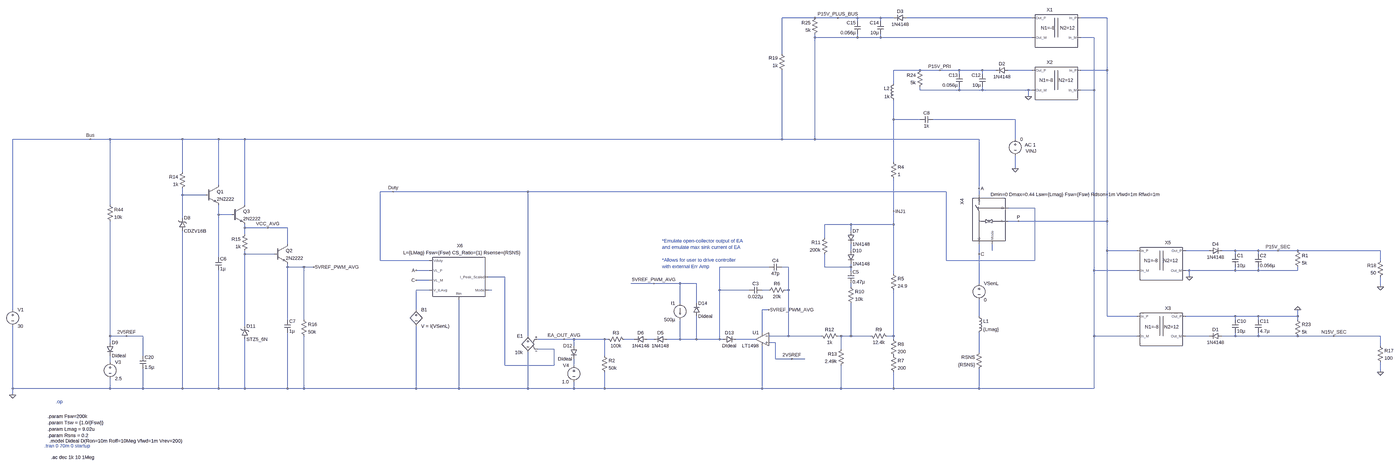
[diagram p0: schematic SU_PSU_Averaged_Model_AC_Sim.asc, whole sheet]
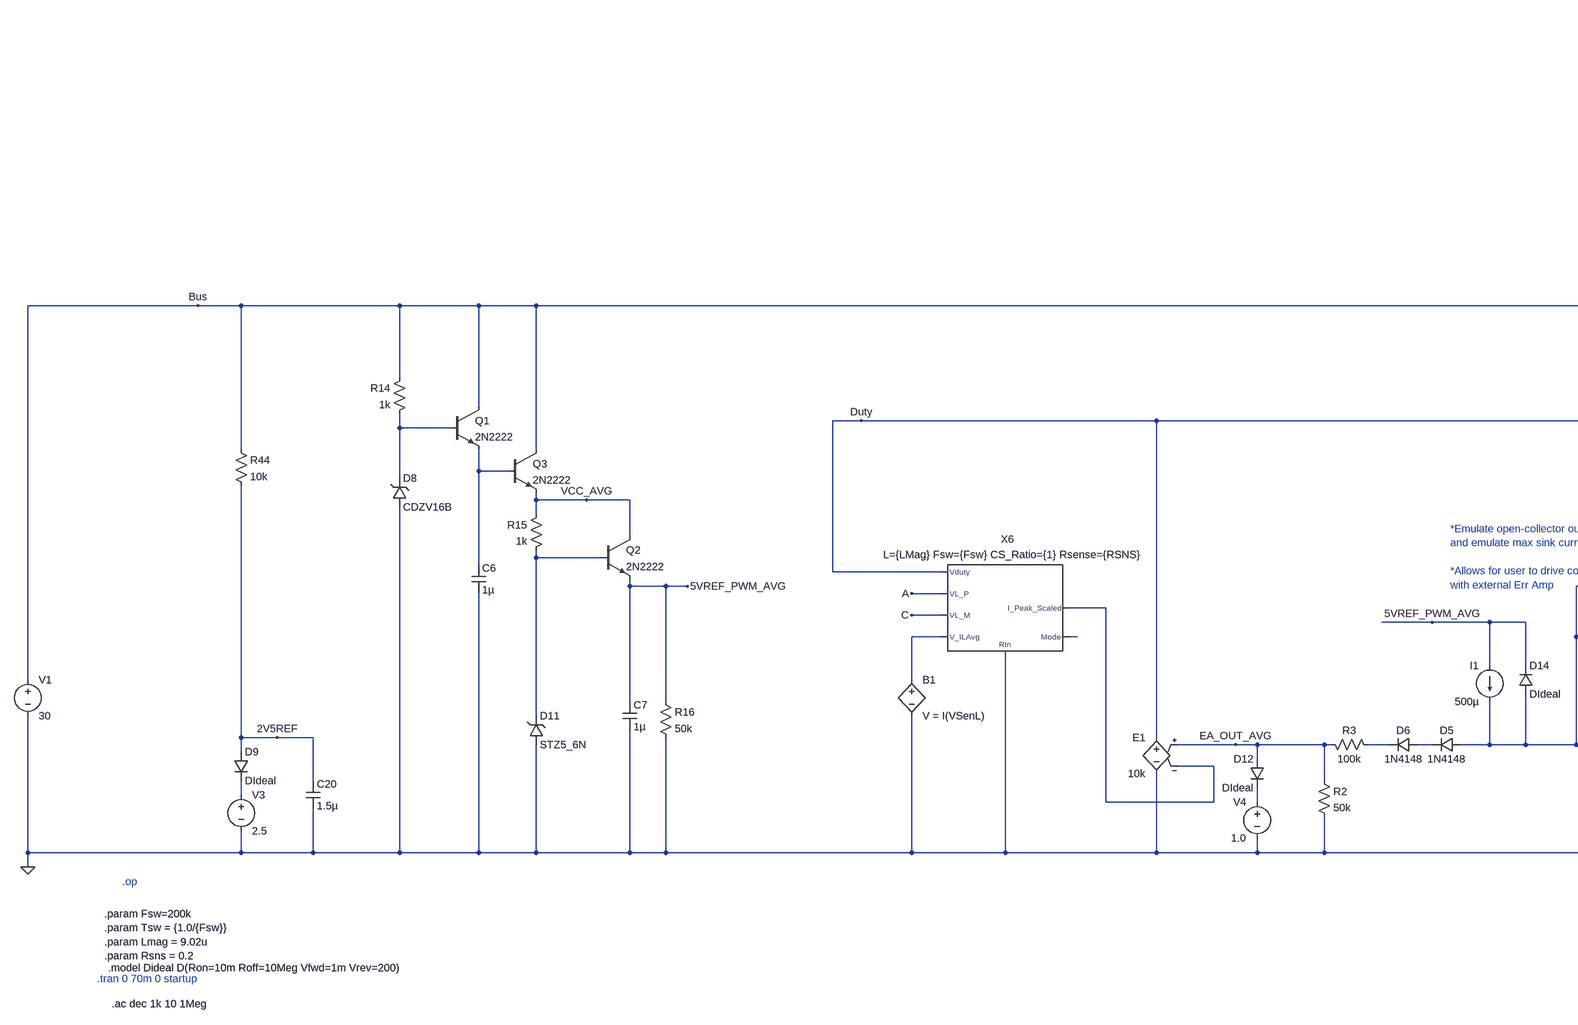
[diagram p1: schematic SU_PSU_Averaged_Model_AC_Sim.asc, part, row 1 of 1, column 1 of 2]
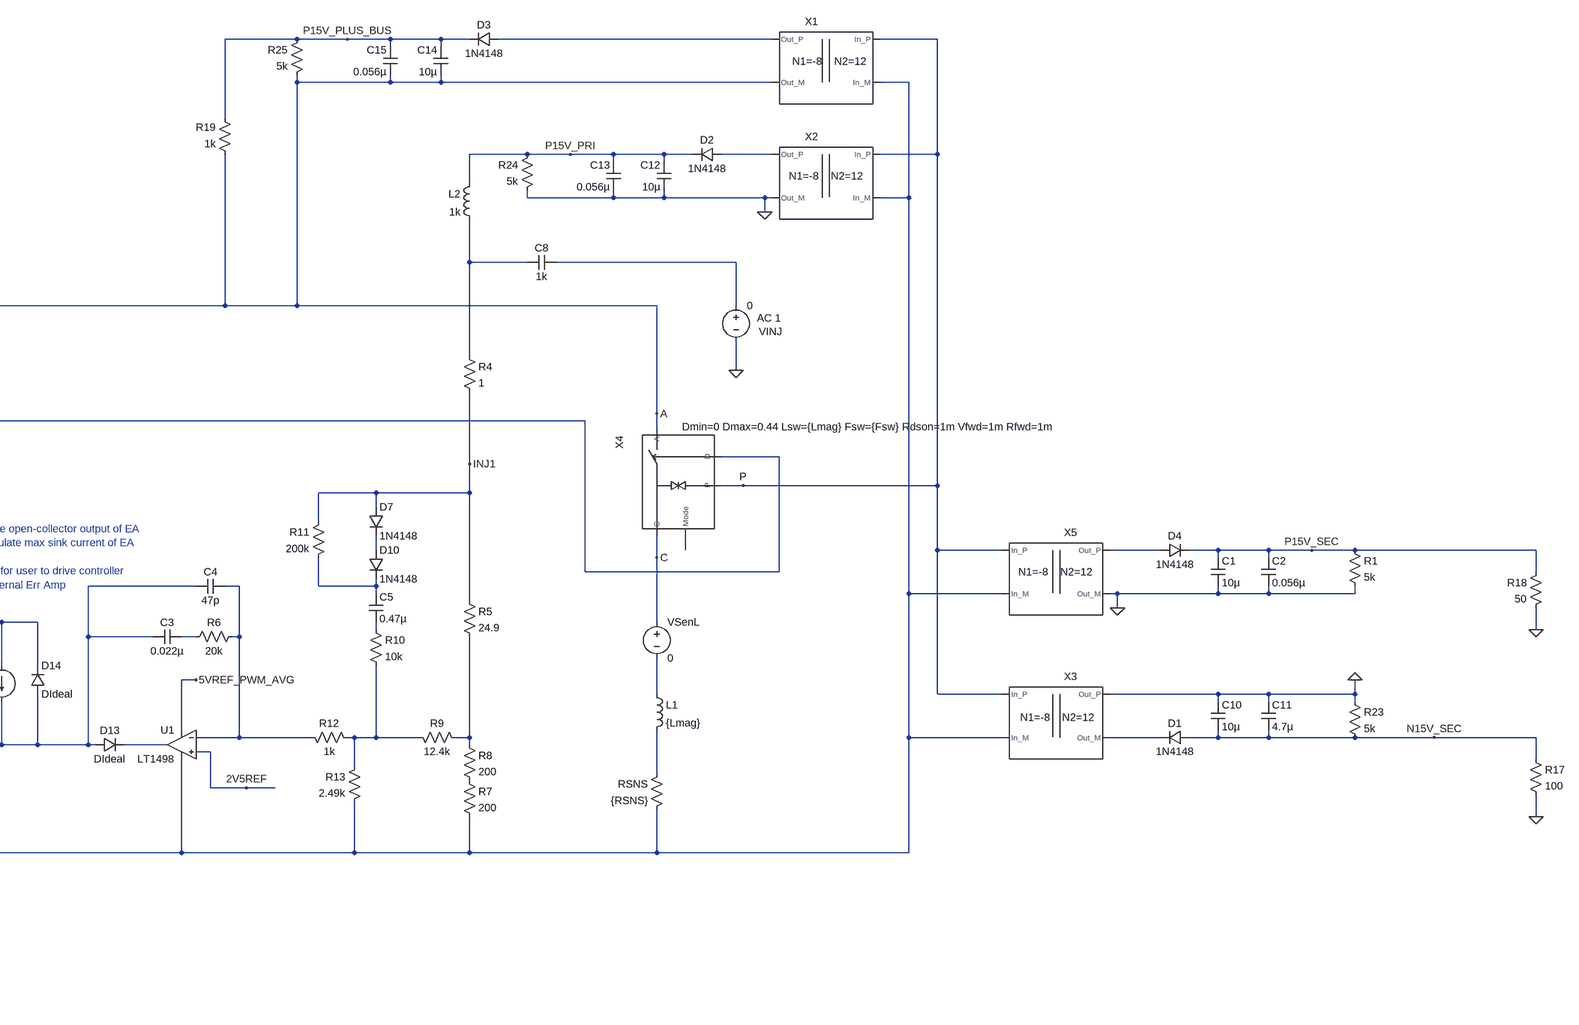
[diagram p2: schematic SU_PSU_Averaged_Model_AC_Sim.asc, part, row 1 of 1, column 2 of 2]
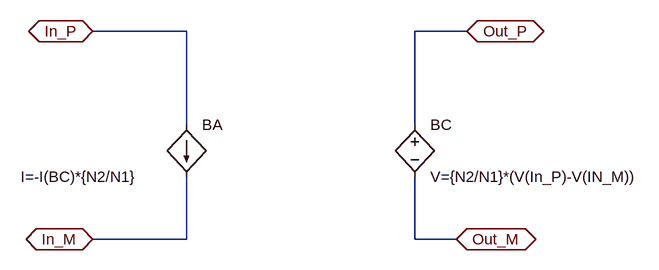
[diagram p3: sub-circuit dc_xfmr.asc]
SU_PSU_Averaged_Model_AC_Sim.asc, the LTspice schematic file:
Version 4.1
SHEET 1 7056 6908
WIRE -1280 -1216 -1440 -1216
WIRE -1168 -1216 -1280 -1216
WIRE -1072 -1216 -1168 -1216
WIRE -960 -1216 -1072 -1216
WIRE -896 -1216 -960 -1216
WIRE -224 -1216 -832 -1216
WIRE 144 -1216 16 -1216
WIRE -1072 -1200 -1072 -1216
WIRE -960 -1200 -960 -1216
WIRE -1280 -1120 -1280 -1136
WIRE -1072 -1120 -1072 -1136
WIRE -1072 -1120 -1280 -1120
WIRE -960 -1120 -960 -1136
WIRE -960 -1120 -1072 -1120
WIRE -224 -1120 -960 -1120
WIRE 80 -1120 16 -1120
WIRE -1440 -1040 -1440 -1216
WIRE -768 -960 -896 -960
WIRE -672 -960 -768 -960
WIRE -576 -960 -672 -960
WIRE -464 -960 -576 -960
WIRE -400 -960 -464 -960
WIRE -224 -960 -336 -960
WIRE 144 -960 144 -1216
WIRE 144 -960 16 -960
WIRE -576 -944 -576 -960
WIRE -464 -944 -464 -960
WIRE -896 -896 -896 -960
WIRE -768 -864 -768 -880
WIRE -576 -864 -576 -880
WIRE -576 -864 -768 -864
WIRE -464 -864 -464 -880
WIRE -464 -864 -576 -864
WIRE -240 -864 -464 -864
WIRE -224 -864 -240 -864
WIRE 80 -864 80 -1120
WIRE 80 -864 16 -864
WIRE -240 -832 -240 -864
WIRE -896 -720 -896 -816
WIRE -768 -720 -896 -720
WIRE -304 -720 -704 -720
WIRE -4928 -624 -5488 -624
WIRE -4832 -624 -4928 -624
WIRE -4480 -624 -4832 -624
WIRE -4304 -624 -4480 -624
WIRE -4176 -624 -4304 -624
WIRE -1440 -624 -1440 -960
WIRE -1440 -624 -4176 -624
WIRE -1280 -624 -1280 -1120
WIRE -1280 -624 -1440 -624
WIRE -480 -624 -1280 -624
WIRE -304 -624 -304 -720
WIRE -896 -512 -896 -720
WIRE -304 -480 -304 -544
WIRE -4480 -464 -4480 -624
WIRE -4304 -400 -4304 -624
WIRE -480 -384 -480 -624
WIRE -3440 -368 -3504 -368
WIRE -2784 -368 -3440 -368
WIRE -640 -368 -2784 -368
WIRE -4480 -352 -4480 -384
WIRE -4368 -352 -4480 -352
WIRE -480 -352 -480 -384
WIRE -4832 -304 -4832 -624
WIRE -4176 -304 -4176 -624
WIRE -208 -288 -336 -288
WIRE -896 -272 -896 -432
WIRE -4304 -256 -4304 -304
WIRE -4240 -256 -4304 -256
WIRE -4480 -240 -4480 -352
WIRE -288 -224 -336 -224
WIRE 144 -224 144 -960
WIRE 144 -224 -288 -224
WIRE -1104 -208 -1232 -208
WIRE -896 -208 -896 -272
WIRE -896 -208 -1104 -208
WIRE -4176 -192 -4176 -208
WIRE -4064 -192 -4176 -192
WIRE -3968 -192 -4064 -192
WIRE -1104 -176 -1104 -208
WIRE -4176 -160 -4176 -192
WIRE -1232 -144 -1232 -208
WIRE -3968 -112 -3968 -192
WIRE -1104 -80 -1104 -112
WIRE -416 -80 -416 -112
WIRE 144 -80 144 -224
WIRE 288 -80 144 -80
WIRE 640 -80 528 -80
WIRE 768 -80 704 -80
WIRE 880 -80 768 -80
WIRE 976 -80 880 -80
WIRE 1072 -80 976 -80
WIRE 1536 -80 1072 -80
WIRE -4176 -64 -4176 -80
WIRE -4032 -64 -4176 -64
WIRE -480 -64 -480 -112
WIRE 768 -64 768 -80
WIRE 880 -64 880 -80
WIRE -4304 -48 -4304 -256
WIRE -3504 -32 -3504 -368
WIRE -3264 -32 -3504 -32
WIRE -640 -32 -640 -368
WIRE -208 -32 -208 -288
WIRE -208 -32 -640 -32
WIRE 1536 -32 1536 -80
WIRE -3968 0 -3968 -16
WIRE -3888 0 -3968 0
WIRE -3840 0 -3888 0
WIRE -1504 0 -1744 0
WIRE -1408 0 -1440 0
WIRE -1232 0 -1232 -64
WIRE -1104 0 -1104 -16
WIRE -1104 0 -1232 0
WIRE -3264 16 -3328 16
WIRE -1104 16 -1104 0
WIRE 80 16 80 -864
WIRE 288 16 80 16
WIRE 544 16 528 16
WIRE 768 16 768 0
WIRE 768 16 544 16
WIRE 880 16 880 0
WIRE 880 16 768 16
WIRE 1072 16 1072 0
WIRE 1072 16 880 16
WIRE -896 32 -896 -208
WIRE -2896 48 -2976 48
WIRE 544 48 544 16
WIRE -3264 64 -3328 64
WIRE -2064 80 -2176 80
WIRE -1936 80 -2064 80
WIRE -1856 80 -1936 80
WIRE -480 80 -480 -64
WIRE -1104 96 -1104 80
WIRE 1536 96 1536 48
WIRE -3264 112 -3328 112
WIRE -2960 112 -2976 112
WIRE -1744 112 -1744 0
WIRE -1600 112 -1744 112
WIRE -1504 112 -1536 112
WIRE -1408 112 -1408 0
WIRE -1408 112 -1424 112
WIRE -1936 176 -1936 80
WIRE -1856 176 -1856 80
WIRE -5488 208 -5488 -624
WIRE -3328 208 -3328 112
WIRE -1504 208 -1536 208
WIRE -480 240 -480 160
WIRE 144 240 144 -80
WIRE 288 240 144 240
WIRE 768 240 528 240
WIRE 880 240 768 240
WIRE 1072 240 1072 208
WIRE 1072 240 880 240
WIRE -3968 256 -3968 0
WIRE -3888 256 -3888 0
WIRE 768 256 768 240
WIRE 880 256 880 240
WIRE 1072 256 1072 240
WIRE -4176 288 -4176 -64
WIRE -1536 320 -1536 208
WIRE -4832 336 -4832 -224
WIRE -4752 336 -4832 336
WIRE -4672 336 -4752 336
WIRE -2784 336 -2784 -368
WIRE -1408 336 -1408 112
WIRE -1408 336 -1504 336
WIRE -1248 336 -1408 336
WIRE -1152 336 -1168 336
WIRE -1104 336 -1104 176
WIRE -1104 336 -1152 336
WIRE -1008 336 -1104 336
WIRE -896 336 -896 112
WIRE -896 336 -928 336
WIRE 80 336 80 16
WIRE 288 336 80 336
WIRE 640 336 528 336
WIRE 768 336 768 320
WIRE 768 336 704 336
WIRE 880 336 880 320
WIRE 880 336 768 336
WIRE 1072 336 880 336
WIRE 1248 336 1072 336
WIRE 1536 336 1248 336
WIRE -2608 352 -2736 352
WIRE -2560 352 -2608 352
WIRE -2304 352 -2560 352
WIRE -2288 352 -2304 352
WIRE -2160 352 -2208 352
WIRE -2064 352 -2096 352
WIRE -1936 352 -1936 256
WIRE -1936 352 -2000 352
WIRE -1856 352 -1856 240
WIRE -1856 352 -1936 352
WIRE -1744 352 -1744 112
WIRE -1744 352 -1856 352
WIRE -1728 352 -1744 352
WIRE -1568 352 -1664 352
WIRE -896 352 -896 336
WIRE -4832 368 -4832 336
WIRE -1472 368 -1504 368
WIRE -2560 384 -2560 352
WIRE 1536 384 1536 336
WIRE -2656 400 -2736 400
WIRE -1152 400 -1152 336
WIRE -480 416 -480 320
WIRE -4672 432 -4672 336
WIRE -2304 432 -2304 352
WIRE -1472 448 -1472 368
WIRE -1392 448 -1472 448
WIRE -1328 448 -1392 448
WIRE -4832 464 -4832 432
WIRE -2896 480 -2896 48
WIRE -2656 480 -2656 400
WIRE -2656 480 -2896 480
WIRE -2560 480 -2560 448
WIRE 1536 512 1536 464
WIRE -5488 592 -5488 288
WIRE -4832 592 -4832 544
WIRE -4832 592 -5488 592
WIRE -4672 592 -4672 496
WIRE -4672 592 -4832 592
WIRE -4480 592 -4480 -176
WIRE -4480 592 -4672 592
WIRE -4304 592 -4304 16
WIRE -4304 592 -4480 592
WIRE -4176 592 -4176 352
WIRE -4176 592 -4304 592
WIRE -3968 592 -3968 320
WIRE -3968 592 -4176 592
WIRE -3888 592 -3888 336
WIRE -3888 592 -3968 592
WIRE -3328 592 -3328 288
WIRE -3328 592 -3888 592
WIRE -3120 592 -3120 160
WIRE -3120 592 -3328 592
WIRE -2784 592 -2784 416
WIRE -2784 592 -3120 592
WIRE -2560 592 -2560 560
WIRE -2560 592 -2784 592
WIRE -2304 592 -2304 512
WIRE -2304 592 -2560 592
WIRE -1536 592 -1536 384
WIRE -1536 592 -2304 592
WIRE -1152 592 -1152 480
WIRE -1152 592 -1536 592
WIRE -896 592 -896 512
WIRE -896 592 -1152 592
WIRE -480 592 -480 496
WIRE -480 592 -896 592
WIRE 80 592 80 336
WIRE 80 592 -480 592
WIRE -5488 624 -5488 592
FLAG -288 -224 P
FLAG -480 -64 C
FLAG -480 -384 A
FLAG -3440 -368 Duty
FLAG -3328 16 A
FLAG -3328 64 C
FLAG -4928 -624 Bus
FLAG -4752 336 2V5REF
FLAG -240 -832 0
FLAG -5488 624 0
FLAG -1168 -1216 P15V_PLUS_BUS
FLAG -672 -960 P15V_PRI
FLAG 544 48 0
FLAG 976 -80 P15V_SEC
FLAG 1248 336 N15V_SEC
FLAG -1504 208 5VREF_PWM_AVG
FLAG -2608 352 EA_OUT_AVG
FLAG -4064 -192 VCC_AVG
FLAG -3840 0 5VREF_PWM_AVG
FLAG -1392 448 2V5REF
FLAG 1072 208 0
FLAG 1536 512 0
FLAG 1536 96 0
FLAG -2064 80 5VREF_PWM_AVG
FLAG -896 -272 INJ1
FLAG -304 -480 0
DATAFLAG -1664 -624 ""
DATAFLAG -3312 16 ""
DATAFLAG -3296 64 ""
DATAFLAG -3312 112 ""
DATAFLAG -4880 336 ""
DATAFLAG 192 -80 ""
DATAFLAG -1344 336 ""
DATAFLAG -2944 -368 ""
DATAFLAG -880 -960 ""
DATAFLAG 1312 -80 ""
DATAFLAG 1440 336 ""
DATAFLAG -1408 -1216 ""
DATAFLAG -2400 352 ""
SYMBOL DC_Xfmr -96 -1168 M0
WINDOW 39 0 17 Bottom 2
SYMATTR SpiceLine N1=-8    N2=12
SYMATTR InstName X1
SYMBOL DC_Xfmr -96 -912 M0
WINDOW 39 7 16 Bottom 2
SYMATTR SpiceLine N1=-8    N2=12
SYMATTR InstName X2
SYMBOL DC_Xfmr 400 288 R0
WINDOW 39 11 19 Bottom 2
SYMATTR SpiceLine N1=-8    N2=12
SYMATTR InstName X3
SYMBOL ind -496 224 R0
SYMATTR InstName L1
SYMATTR Value {Lmag}
SYMBOL PWM_SW_VM_Lossy -416 -416 M90
WINDOW 0 96 -131 Bottom 2
WINDOW 39 77 404 VBottom 2
SYMATTR InstName X4
SYMATTR SpiceLine Dmin=0 Dmax=0.44 Lsw={Lmag} Fsw={Fsw} Rdson=1m Vfwd=1m Rfwd=1m
SYMBOL voltage -480 64 R0
WINDOW 123 0 0 Left 0
WINDOW 39 0 0 Left 0
SYMATTR InstName VSenL
SYMATTR Value 0
SYMBOL voltage -5488 192 R0
WINDOW 123 0 0 Left 0
WINDOW 39 0 0 Left 0
SYMATTR InstName V1
SYMATTR Value 30
SYMBOL diode 704 320 R90
WINDOW 0 0 32 VBottom 2
WINDOW 3 32 32 VTop 2
SYMATTR InstName D1
SYMATTR Value 1N4148
SYMBOL diode -336 -944 M270
WINDOW 0 32 32 VTop 2
WINDOW 3 0 32 VBottom 2
SYMATTR InstName D2
SYMATTR Value 1N4148
SYMBOL diode -832 -1200 M270
WINDOW 0 32 32 VTop 2
WINDOW 3 0 32 VBottom 2
SYMATTR InstName D3
SYMATTR Value 1N4148
SYMBOL Peak_Current_Sense -3120 48 R0
WINDOW 0 5 -137 Bottom 2
WINDOW 39 14 -103 Bottom 2
SYMATTR InstName X6
SYMATTR SpiceLine L={LMag} Fsw={Fsw} CS_Ratio={1} Rsense={RSNS}
SYMBOL bv -3328 192 R0
SYMATTR InstName B1
SYMATTR Value V = I(VSenL)
SYMBOL cap 752 256 R0
SYMATTR InstName C10
SYMATTR Value 10µ
SYMBOL cap 864 256 R0
SYMATTR InstName C11
SYMATTR Value 4.7µ
SYMBOL res 1056 240 R0
SYMATTR InstName R23
SYMATTR Value 5k
SYMBOL cap -448 -944 M0
SYMATTR InstName C12
SYMATTR Value 10µ
SYMBOL cap -560 -944 M0
SYMATTR InstName C13
SYMATTR Value 0.056µ
SYMBOL res -752 -976 M0
SYMATTR InstName R24
SYMATTR Value 5k
SYMBOL cap -944 -1200 M0
SYMATTR InstName C14
SYMATTR Value 10µ
SYMBOL cap -1056 -1200 M0
SYMATTR InstName C15
SYMATTR Value 0.056µ
SYMBOL res -1264 -1232 M0
SYMATTR InstName R25
SYMATTR Value 5k
SYMBOL voltage -4832 448 R0
WINDOW 123 0 0 Left 0
WINDOW 39 0 0 Left 0
SYMATTR InstName V3
SYMATTR Value 2.5
SYMBOL res -4848 -320 R0
SYMATTR InstName R44
SYMATTR Value 10k
SYMBOL diode -4848 368 R0
SYMATTR InstName D9
SYMATTR Value DIdeal
SYMBOL cap -4688 432 R0
SYMATTR InstName C20
SYMATTR Value 1.5µ
SYMBOL res -464 400 M0
SYMATTR InstName RSNS
SYMATTR Value {RSNS}
SYMBOL DC_Xfmr 400 -32 R0
WINDOW 39 7 16 Bottom 2
SYMATTR SpiceLine N1=-8    N2=12
SYMATTR InstName X5
SYMBOL diode 640 -64 R270
WINDOW 0 32 32 VTop 2
WINDOW 3 0 32 VBottom 2
SYMATTR InstName D4
SYMATTR Value 1N4148
SYMBOL cap 752 -64 R0
SYMATTR InstName C1
SYMATTR Value 10µ
SYMBOL cap 864 -64 R0
SYMATTR InstName C2
SYMATTR Value 0.056µ
SYMBOL res 1056 -96 R0
SYMATTR InstName R1
SYMATTR Value 5k
SYMBOL diode -2000 368 M270
WINDOW 0 32 32 VTop 2
WINDOW 3 0 32 VBottom 2
SYMATTR InstName D5
SYMATTR Value 1N4148
SYMBOL diode -2096 368 M270
WINDOW 0 32 32 VTop 2
WINDOW 3 0 32 VBottom 2
SYMATTR InstName D6
SYMATTR Value 1N4148
SYMBOL res -2320 416 R0
SYMATTR InstName R2
SYMATTR Value 50k
SYMBOL res -2192 368 M270
WINDOW 0 32 56 VTop 2
WINDOW 3 0 56 VBottom 2
SYMATTR InstName R3
SYMATTR Value 100k
SYMBOL res -912 -528 R0
SYMATTR InstName R4
SYMATTR Value 1
SYMBOL res -912 16 R0
SYMATTR InstName R5
SYMATTR Value 24.9
SYMBOL cap -1536 96 R90
WINDOW 0 0 32 VBottom 2
WINDOW 3 32 32 VTop 2
SYMATTR InstName C3
SYMATTR Value 0.022µ
SYMBOL res -1408 96 R90
WINDOW 0 0 56 VBottom 2
WINDOW 3 32 56 VTop 2
SYMATTR InstName R6
SYMATTR Value 20k
SYMBOL cap -1440 -16 R90
WINDOW 0 0 32 VBottom 2
WINDOW 3 32 32 VTop 2
SYMATTR InstName C4
SYMATTR Value 47p
SYMBOL res -912 416 R0
SYMATTR InstName R7
SYMATTR Value 200
SYMBOL res -912 336 R0
SYMATTR InstName R8
SYMATTR Value 200
SYMBOL res -1024 320 M90
WINDOW 0 0 56 VBottom 2
WINDOW 3 32 56 VTop 2
SYMATTR InstName R9
SYMATTR Value 12.4k
SYMBOL res -1120 80 R0
SYMATTR InstName R10
SYMATTR Value 10k
SYMBOL cap -1120 16 R0
SYMATTR InstName C5
SYMATTR Value 0.47µ
SYMBOL res -1216 -160 M0
SYMATTR InstName R11
SYMATTR Value 200k
SYMBOL res -1264 320 M90
WINDOW 0 0 56 VBottom 2
WINDOW 3 32 56 VTop 2
SYMATTR InstName R12
SYMATTR Value 1k
SYMBOL res -1136 384 M0
SYMATTR InstName R13
SYMATTR Value 2.49k
SYMBOL OpAmps\\LT1498 -1536 288 M0
SYMATTR InstName U1
SYMBOL zener -4496 -176 M180
WINDOW 0 24 64 Left 2
WINDOW 3 24 0 Left 2
SYMATTR InstName D8
SYMATTR Value CDZV16B
SYMBOL res -4464 -480 M0
SYMATTR InstName R14
SYMATTR Value 1k
SYMBOL npn -4368 -400 R0
SYMATTR InstName Q1
SYMATTR Value 2N2222
SYMBOL cap -4320 -48 R0
SYMATTR InstName C6
SYMATTR Value 1µ
SYMBOL zener -4192 352 M180
WINDOW 0 24 64 Left 2
WINDOW 3 24 0 Left 2
SYMATTR InstName D11
SYMATTR Value STZ5_6N
SYMBOL res -4160 -176 M0
SYMATTR InstName R15
SYMATTR Value 1k
SYMBOL npn -4032 -112 R0
SYMATTR InstName Q2
SYMATTR Value 2N2222
SYMBOL cap -3984 256 R0
SYMATTR InstName C7
SYMATTR Value 1µ
SYMBOL res -3904 240 R0
SYMATTR InstName R16
SYMATTR Value 50k
SYMBOL npn -4240 -304 R0
SYMATTR InstName Q3
SYMATTR Value 2N2222
SYMBOL e -2784 320 M0
SYMATTR InstName E1
SYMATTR Value 10k
SYMBOL diode -1120 -176 R0
SYMATTR InstName D7
SYMATTR Value 1N4148
SYMBOL diode -1120 -80 R0
SYMATTR InstName D10
SYMATTR Value 1N4148
SYMBOL voltage -2560 464 M0
WINDOW 123 0 0 Left 0
WINDOW 39 0 0 Left 0
SYMATTR InstName V4
SYMATTR Value 1.0
SYMBOL diode -2544 384 M0
SYMATTR InstName D12
SYMATTR Value DIdeal
SYMBOL res 1520 368 R0
SYMATTR InstName R17
SYMATTR Value 100
SYMBOL res 1552 -48 M0
SYMATTR InstName R18
SYMATTR Value 50
SYMBOL current -1936 176 M0
WINDOW 123 0 0 Left 0
WINDOW 39 0 0 Left 0
SYMATTR InstName I1
SYMATTR Value 500µ
SYMBOL diode -1872 240 M180
WINDOW 0 24 64 Left 2
WINDOW 3 24 0 Left 2
SYMATTR InstName D14
SYMATTR Value DIdeal
SYMBOL diode -1728 336 M90
WINDOW 0 0 32 VBottom 2
WINDOW 3 32 32 VTop 2
SYMATTR InstName D13
SYMATTR Value DIdeal
SYMBOL res -1424 -944 R180
WINDOW 0 36 76 Left 2
WINDOW 3 36 40 Left 2
SYMATTR InstName R19
SYMATTR Value 1k
SYMBOL voltage -304 -640 R0
WINDOW 0 51 74 Left 2
WINDOW 3 24 16 Left 2
WINDOW 123 47 44 Left 2
WINDOW 39 0 0 Left 0
SYMATTR InstName VINJ
SYMATTR Value 0
SYMATTR Value2 AC 1
SYMBOL cap -704 -736 R90
WINDOW 0 0 32 VBottom 2
WINDOW 3 32 32 VTop 2
SYMATTR InstName C8
SYMATTR Value 1k
SYMBOL ind -880 -912 M0
SYMATTR InstName L2
SYMATTR Value 1k
TEXT -5096 656 Left 2 ;.op
TEXT -5136 728 Left 2 !.param Fsw=200k\n.param Tsw = {1.0/{Fsw}}\n.param Lmag = 9.02u\n.param Rsns = 0.2
TEXT -5128 848 Left 2 !.model Dideal D(Ron=10m Roff=10Meg Vfwd=1m Vrev=200)
TEXT -5152 872 Left 2 ;.tran 0 70m 0 startup
TEXT -2024 -128 Left 2 ;*Emulate open-collector output of EA\nand emulate max sink current of EA\n \n*Allows for user to drive controller\nwith external Err Amp
TEXT -5120 928 Left 2 !.ac dec 1k 10 1Meg

dc_xfmr.asc, the sub-circuit schematic file:
Version 4.1
SHEET 1 2180 2052
WIRE -48 -48 -192 -48
WIRE 384 -48 304 -48
WIRE -48 96 -48 -48
WIRE 304 96 304 -48
WIRE -48 272 -48 176
WIRE -48 272 -192 272
WIRE 304 272 304 176
WIRE 368 272 304 272
FLAG -192 -48 In_P
IOPIN -192 -48 BiDir
FLAG 368 272 Out_M
IOPIN 368 272 BiDir
FLAG 384 -48 Out_P
IOPIN 384 -48 BiDir
FLAG -192 272 In_M
IOPIN -192 272 BiDir
SYMBOL bv 304 80 R0
SYMATTR InstName BC
SYMATTR Value V={N2/N1}*(V(In_P)-V(IN_M))
SYMBOL bi -48 96 R0
WINDOW 3 -255 80 Left 2
SYMATTR Value I=-I(BC)*{N2/N1}
SYMATTR InstName BA

The netlist it stands for:
* SU_PSU_Averaged_Model_AC_Sim.asc
X§X1 0 P Bus N001 dc_xfmr params: N1=-8    N2=12
X§X2 0 P 0 N002 dc_xfmr params: N1=-8    N2=12
X§X3 0 P N022 0 dc_xfmr params: N1=-8    N2=12
L1 N019 N026 {Lmag}
X§X4 Bus C Duty N008 P PWM_SW_VM_Lossy params: Dmin=0 Dmax=0.44 Lsw={Lmag} Fsw={Fsw} Rdson=1m Vfwd=1m Rfwd=1m  ; pins A C D Mode P
VSenL C N019 0
V1 Bus 0 30
D1 N15V_SEC N022 1N4148
D2 N002 P15V_PRI 1N4148
D3 N001 P15V_PLUS_BUS 1N4148
X§X6 N014 0 N016 Duty C Bus N017 Peak_Current_Sense params: L={LMag} Fsw={Fsw} CS_Ratio={1} Rsense={RSNS}  ; pins I_Peak_Scaled Rtn V_ILAvg Vduty VL_M VL_P Mode
B1 N016 0 V = I(VSenL)
C10 0 N15V_SEC 10µ
C11 0 N15V_SEC 4.7µ
R23 0 N15V_SEC 5k
C12 P15V_PRI 0 10µ
C13 P15V_PRI 0 0.056µ
R24 P15V_PRI 0 5k
C14 P15V_PLUS_BUS Bus 10µ
C15 P15V_PLUS_BUS Bus 0.056µ
R25 P15V_PLUS_BUS Bus 5k
V3 N027 0 2.5
R44 Bus 2V5REF 10k
D9 2V5REF N027 DIdeal
C20 2V5REF 0 1.5µ
RSNS N026 0 {RSNS}
X§X5 0 P 0 N009 dc_xfmr params: N1=-8    N2=12
D4 N009 P15V_SEC 1N4148
C1 P15V_SEC 0 10µ
C2 P15V_SEC 0 0.056µ
R1 P15V_SEC 0 5k
D5 N011 N024 1N4148
D6 N024 N023 1N4148
R2 EA_OUT_AVG 0 50k
R3 N023 EA_OUT_AVG 100k
R4 N003 INJ1 1
R5 INJ1 N021 24.9
C3 N018 N011 0.022µ
R6 N012 N018 20k
C4 N012 N011 47p
R7 P001 0 200
R8 N021 P001 200
R9 N020 N021 12.4k
R10 N015 N020 10k
C5 N013 N015 0.47µ
R11 INJ1 N013 200k
R12 N012 N020 1k
R13 N020 0 2.49k
X§U1 2V5REF N012 5VREF_PWM_AVG 0 N025 LT1498  ; pins In+ In- V+ V- OUT
D8 0 N005 CDZV16B
R14 Bus N005 1k
Q1 Bus N005 N006 0 2N2222
C6 N006 0 1µ
D11 0 N010 STZ5_6N
R15 VCC_AVG N010 1k
Q2 VCC_AVG N010 5VREF_PWM_AVG 0 2N2222
C7 5VREF_PWM_AVG 0 1µ
R16 5VREF_PWM_AVG 0 50k
Q3 Bus N006 VCC_AVG 0 2N2222
E1 Duty 0 EA_OUT_AVG N014 10k
D7 INJ1 N007 1N4148
D10 N007 N013 1N4148
V4 N028 0 1.0
D12 EA_OUT_AVG N028 DIdeal
R17 N15V_SEC 0 100
R18 P15V_SEC 0 50
I1 5VREF_PWM_AVG N011 500µ
D14 N011 5VREF_PWM_AVG DIdeal
D13 N011 N025 DIdeal
R19 Bus P15V_PLUS_BUS 1k
VINJ N004 0 0 AC 1
C8 N004 N003 1k
L2 P15V_PRI N003 1k

* block symbol definitions
.subckt dc_xfmr In_M In_P Out_M Out_P
BC Out_P Out_M V={N2/N1}*(V(In_P)-V(IN_M))
BA In_P In_M I=-I(BC)*{N2/N1}
.ends dc_xfmr

.model D D
.lib standard.dio
.model NPN NPN
.model PNP PNP
.lib standard.bjt
* .op
.param Fsw=200k
.param Tsw = {1.0/{Fsw}}
.param Lmag = 9.02u
.param Rsns = 0.2
.model Dideal D(Ron=10m Roff=10Meg Vfwd=1m Vrev=200)
* .tran 0 70m 0 startup
* *Emulate open-collector output of EA
* and emulate max sink current of EA
* *Allows for user to drive controller
* with external Err Amp
.ac dec 1k 10 1Meg
.lib LTC.lib
.backanno
.end